# Altium schematic sheet SchemaSuperstar.SchDoc
size A4; SheetNumber: 1; SheetTotal: 1
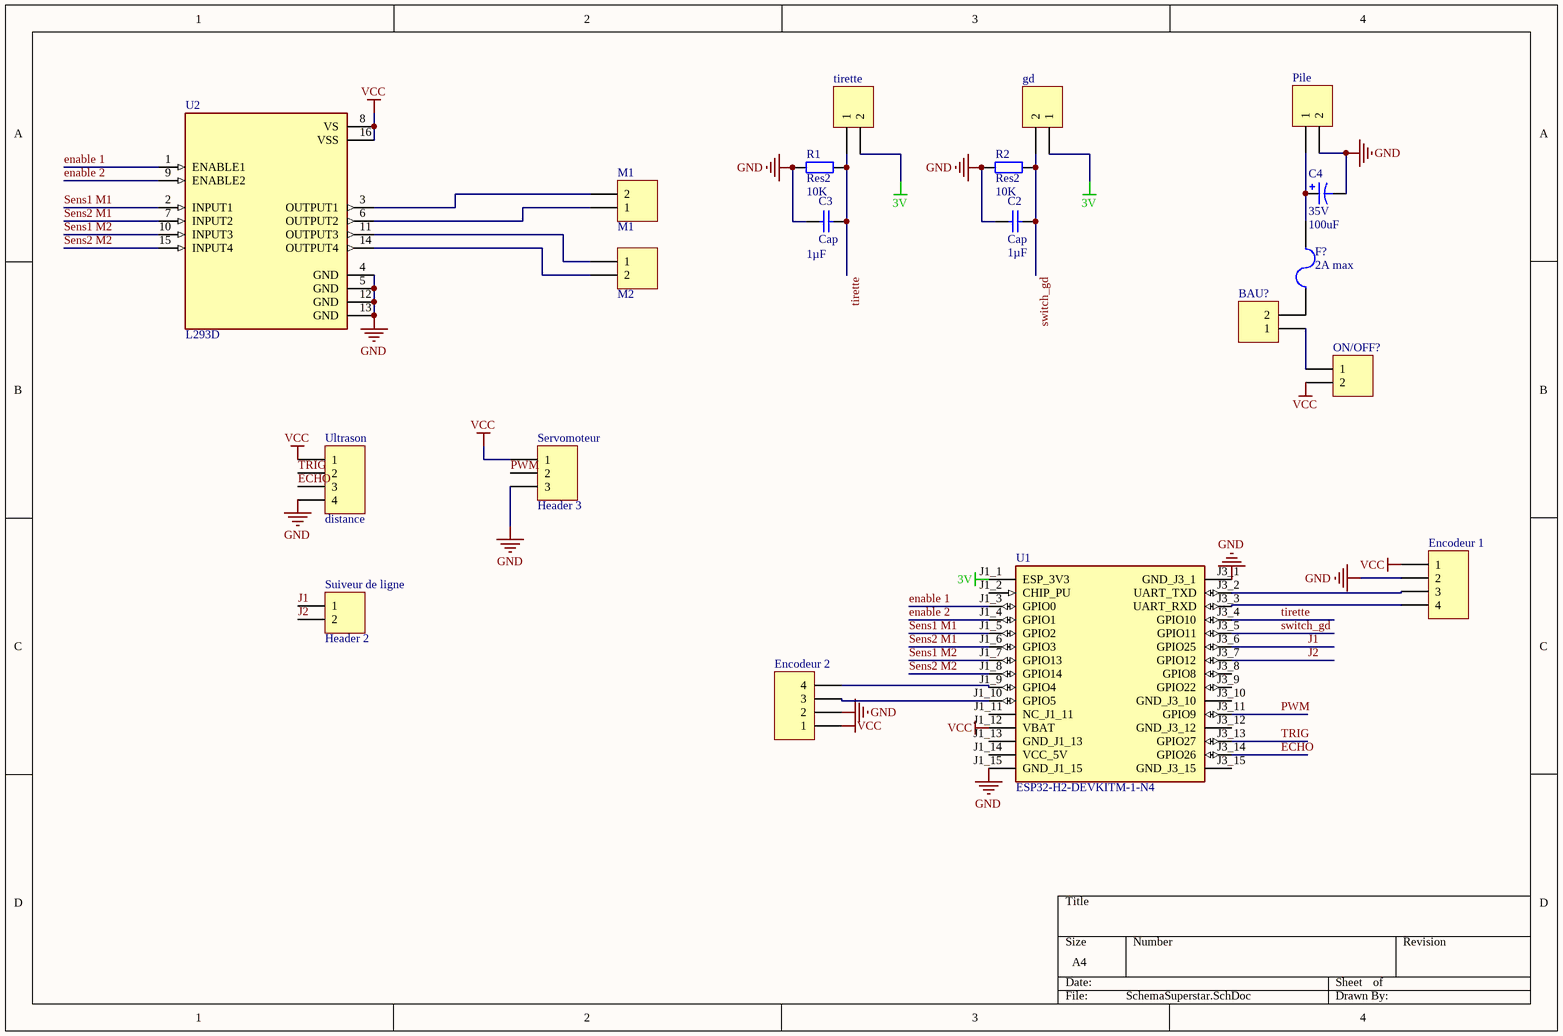
[diagram p0: SchemaSuperstar.SchDoc]

## Parts
BAU?  (no value)  [S2B-XH-A]
C2  Cap  value 1µF  [Capacitor 1206]
C3  Cap  value 1µF  [Capacitor 1206]
C4  35V  value 100uF  [Condensateur]
Encodeur_1  (no value)  [B4BXHALFSN]
Encodeur_2  (no value)  [B4BXHALFSN]
F?  2A max  [PIN-W2/E2.8]
gd  (no value)  [S2B-XH-A]
M1  M1  [S2B-XH-A]
M?  M2  [S2B-XH-A]
ON/OFF?  (no value)  [S2B-XH-A]
Pile  (no value)  [S2B-XH-A]
R1  Res2  value 10K  [Resistor 1206]
R2  Res2  value 10K  [Resistor 1206]
Servomoteur  Header 3  [HDR1X3]
Suiveur_de_ligne  Header 2  [HDR1X2]
tirette  (no value)  [S2B-XH-A]
U1  ESP32-H2-DEVKITM-1-N4  [MODULE_ESP32-H2-DEVKITM-1-N4]
U2  L293D  [DIP880W50P254L2000H510Q16]
Ultrason  distance  [HDR1X4]

## Nets
3V: gd.1 tirette.2 U1.J1_1(ESP_3V3)
GND: C2.1 C3.1 C4.2 Encodeur_1.2 Encodeur_2.2 Pile.2 R1.1 R2.1 Servomoteur.3 U1.J1_15(GND_J1_15) U1.J3_1(GND_J3_1) U2.4(GND) U2.5(GND) U2.12(GND) U2.13(GND) Ultrason.4
VCC: Encodeur_1.1 Encodeur_2.1 ON/OFF?.2 Servomoteur.1 U1.J1_12(VBAT) U2.8(VS) U2.16(VSS) Ultrason.1
ECHO: U1.J3_14(GPIO26) Ultrason.3
enable 1: U1.J1_3(GPIO0) U2.1(ENABLE1)
enable 2: U1.J1_4(GPIO1) U2.9(ENABLE2)
J1: Suiveur_de_ligne.1 U1.J3_6(GPIO25)
J2: Suiveur_de_ligne.2 U1.J3_7(GPIO12)
PWM: Servomoteur.2 U1.J3_11(GPIO9)
Sens1 M1: U1.J1_5(GPIO2) U2.2(INPUT1)
Sens1 M2: U1.J1_7(GPIO13) U2.10(INPUT3)
Sens2 M1: U1.J1_6(GPIO3) U2.7(INPUT2)
Sens2 M2: U1.J1_8(GPIO14) U2.15(INPUT4)
switch_gd: C2.2 gd.2 R2.2 U1.J3_5(GPIO11)
tirette: C3.2 R1.2 tirette.1 U1.J3_4(GPIO10)
TRIG: U1.J3_13(GPIO27) Ultrason.2
NetBAU?_1: BAU?.1 ON/OFF?.1
NetBAU?_2: BAU?.2 F?.1
NetC4_1: C4.1 F?.2 Pile.1
NetEncodeur_1_3: Encodeur_1.3 U1.J3_2(UART_TXD)
NetEncodeur_1_4: Encodeur_1.4 U1.J3_3(UART_RXD)
NetEncodeur_2_3: Encodeur_2.3 U1.J1_10(GPIO5)
NetEncodeur_2_4: Encodeur_2.4 U1.J1_9(GPIO4)
NetM1_1: M1.1 U2.6(OUTPUT2)
NetM1_2: M1.2 U2.3(OUTPUT1)
NetM?_1: M?.1 U2.11(OUTPUT3)
NetM?_2: M?.2 U2.14(OUTPUT4)

Not connected (* = marked no-connect by the designer): U1 J1_2(CHIP_PU) J1_11(NC_J1_11) J1_13(GND_J1_13) J1_14(VCC_5V) J3_8(GPIO8) J3_9(GPIO22) J3_10(GND_J3_10) J3_12(GND_J3_12) J3_15(GND_J3_15)

## Library data of the parts
BAU? gd M1 M? ON/OFF? Pile tirette = Header 2H: Header, 2-Pin, Right Angle; LatestRevisionDate: 17-Jul-2002; LatestRevisionNote: Re-released for DXP Platform.; Publisher: Altium Limited
C2 C3 = Cap: Capacitor; Published: 8-Jun-2000; LatestRevisionDate: 17-Jul-2002; LatestRevisionNote: Re-released for DXP Platform.; PackageReference: RAD-0.3; Publisher: Altium Limited; PackageDescription: Radial Cap, Thru-Hole; 2 Leads; 0.3 in Pin Spacing
C4 = Cap Pol1: Polarized Capacitor (Radial); Published: 8-Jun-2000; LatestRevisionDate: 17-Jul-2002; LatestRevisionNote: Re-released for DXP Platform.; PackageReference: RB7.6-15; Publisher: Altium Limited; PackageDescription: Polarized Capacitor (Radial); 2 Leads
Encodeur_1 Encodeur_2 = Header 4H: Header, 4-Pin, Right Angle; LatestRevisionDate: 17-Jul-2002; LatestRevisionNote: Re-released for DXP Platform.; Publisher: Altium Limited
F? = Fuse 2: Fuse; Published: 8-Jun-2000; LatestRevisionDate: 17-Jul-2002; LatestRevisionNote: Re-released for DXP Platform.; PackageReference: PIN-W2/E2.8; Publisher: Altium Limited; PackageDescription: Thru-Hole; 2 Leads
R1 R2 = Res2: Resistor; Published: 8-Jun-2000; LatestRevisionDate: 17-Jul-2002; LatestRevisionNote: Re-released for DXP Platform.; PackageReference: AXIAL-0.4; Publisher: Altium Limited; PackageDescription: Axial Device, Thru-Hole; 2 Leads; 0.4 in Pin Spacing
Servomoteur = Header 3: Header, 3-Pin; LatestRevisionDate: 17-Jul-2002; LatestRevisionNote: Re-released for DXP Platform.; Publisher: Altium Limited
Suiveur_de_ligne = Header 2: Header, 2-Pin; LatestRevisionDate: 17-Jul-2002; LatestRevisionNote: Re-released for DXP Platform.; Publisher: Altium Limited
U1 = ESP32-H2-DEVKITM-1-N4: ESP32-H ESP32-H2-MINI-1 Transceiver; 802.15.4 (ZigBeeÂ®), BluetoothÂ® Smart 4.x Low Energy (BLE) Evaluation Board; MF: Espressif Systems; SnapEDA_Link: https://www.snapeda.com/parts/ESP32-H2-DEVKITM-1-N4/Espressif+Systems/view-part/?ref=snap; Package: None; Value: *; MP: ESP32-H2-DEVKITM-1-N4; Check_prices: https://www.snapeda.com/parts/ESP32-H2-DEVKITM-1-N4/Espressif+Systems/view-part/?ref=eda
U2 = L293D: Bipolar Motor Driver - Parallel 16-PowerDIP; MF: STMicroelectronics; MP: L293D; Package: DIP-16 STMicroelectronics; SnapEDA_Link: https://www.snapeda.com/parts/L293D/STMicroelectronics/view-part/?ref=snap; Purchase-URL: https://pricing.snapeda.com/search/part/L293D/?ref=eda; Check_prices: https://www.snapeda.com/parts/L293D/STMicroelectronics/view-part/?ref=eda; Availability: In Stock; Value: *; Price: None
Ultrason = Header 4: Header, 4-Pin; LatestRevisionDate: 17-Jul-2002; LatestRevisionNote: Re-released for DXP Platform.; Publisher: Altium Limited